# EAGLE schematic PS1 (EAGLE 9.6.2)
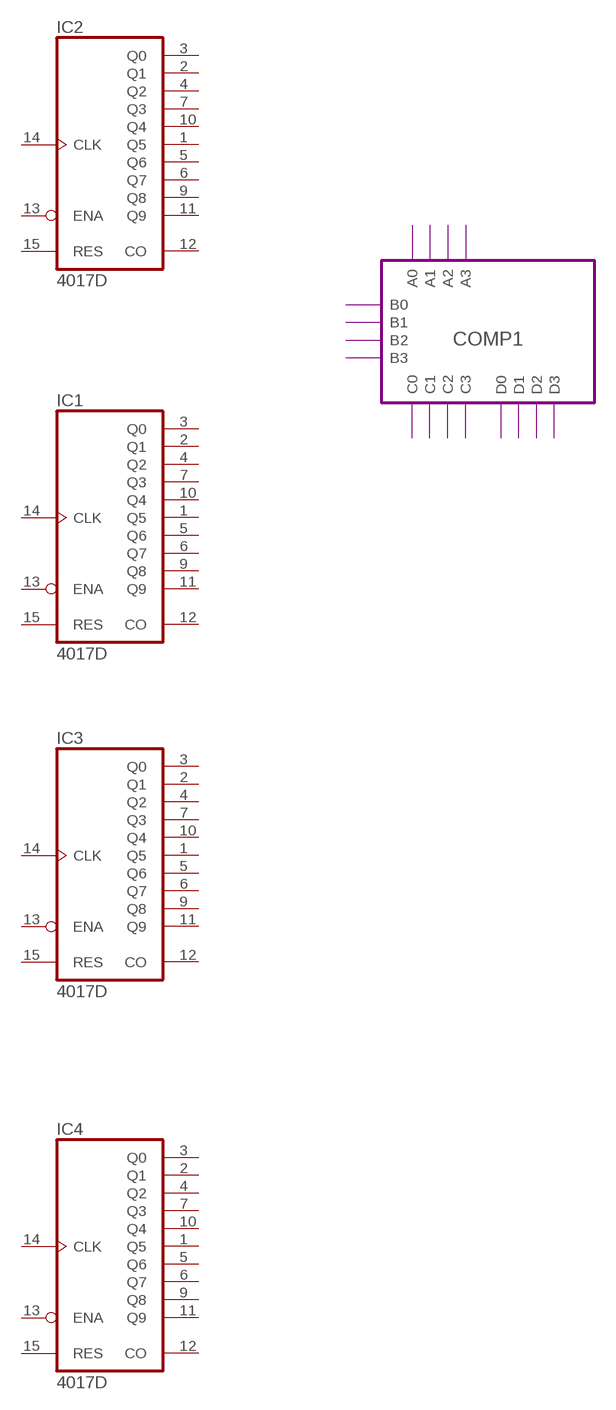
[diagram p0: schematic, sheet 1]

## Parts
IC1  4017D  [SO16]
IC2  4017D  [SO16]
IC3  4017D  [SO16]
IC4  4017D  [SO16]

## Module instances
COMP1 = COMP
Unconnected: IC1.1(Q5) IC1.2(Q1) IC1.3(Q0) IC1.4(Q2) IC1.5(Q6) IC1.6(Q7) IC1.7(Q3) IC1.9(Q8) IC1.10(Q4) IC1.11(Q9) IC1.12(CO) IC1.13(ENA) IC1.14(CLK) IC1.15(RES) IC2.1(Q5) IC2.2(Q1) IC2.3(Q0) IC2.4(Q2) IC2.5(Q6) IC2.6(Q7) IC2.7(Q3) IC2.9(Q8) IC2.10(Q4) IC2.11(Q9) IC2.12(CO) IC2.13(ENA) IC2.14(CLK) IC2.15(RES) IC3.1(Q5) IC3.2(Q1) IC3.3(Q0) IC3.4(Q2) IC3.5(Q6) IC3.6(Q7) IC3.7(Q3) IC3.9(Q8) IC3.10(Q4) IC3.11(Q9) IC3.12(CO) IC3.13(ENA) IC3.14(CLK) IC3.15(RES) IC4.1(Q5) IC4.2(Q1) IC4.3(Q0) IC4.4(Q2) IC4.5(Q6) IC4.6(Q7) IC4.7(Q3) IC4.9(Q8) IC4.10(Q4) IC4.11(Q9) IC4.12(CO) IC4.13(ENA) IC4.14(CLK) IC4.15(RES)

## Power pins joined to a net without a drawn wire
VDD: IC1.16(VDD) IC2.16(VDD) IC3.16(VDD) IC4.16(VDD)
VSS: IC1.8(VSS) IC2.8(VSS) IC3.8(VSS) IC4.8(VSS)

## Library data of the parts
IC1-IC4 = 40xx:4017: COUNTER/DIVIDER

## Module COMP
Ports: A0(io) A1(io) A2(io) A3(io) B0(io) B1(io) B2(io) B3(io) C0(io) C1(io) C2(io) C3(io) D0(io) D1(io) D2(io) D3(io)
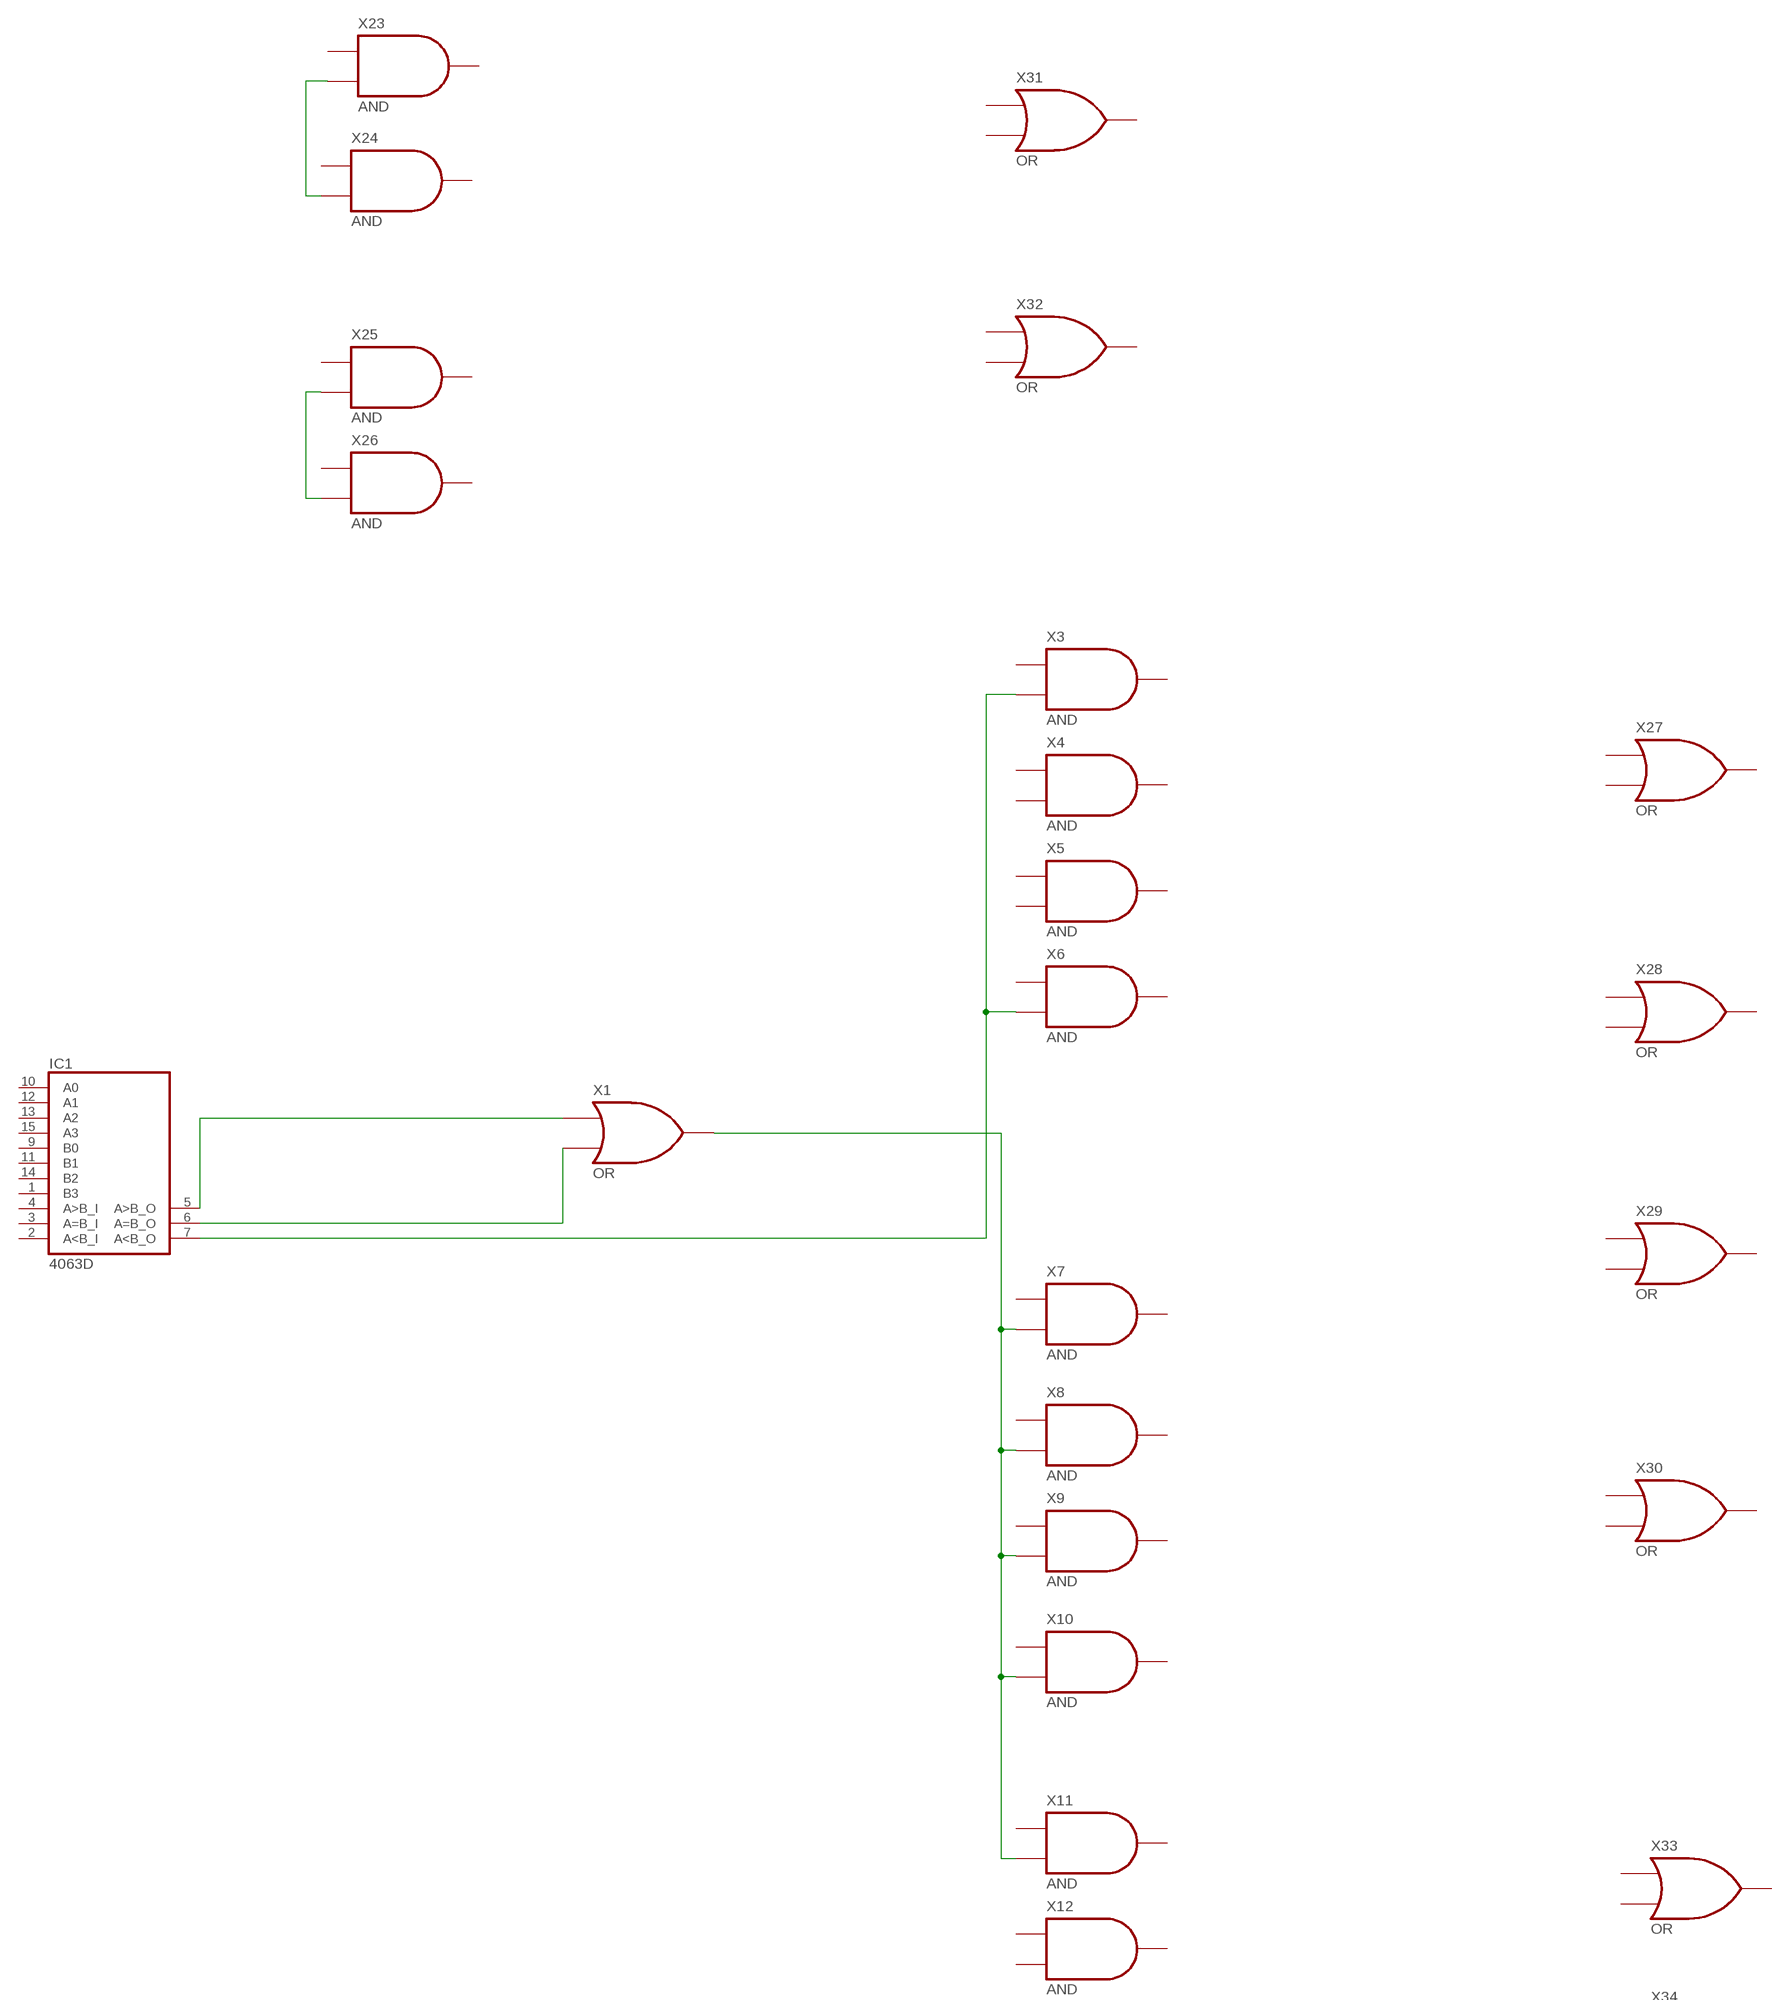
[diagram p1: schematic, module COMP, sheet 1, part 1 of 2]
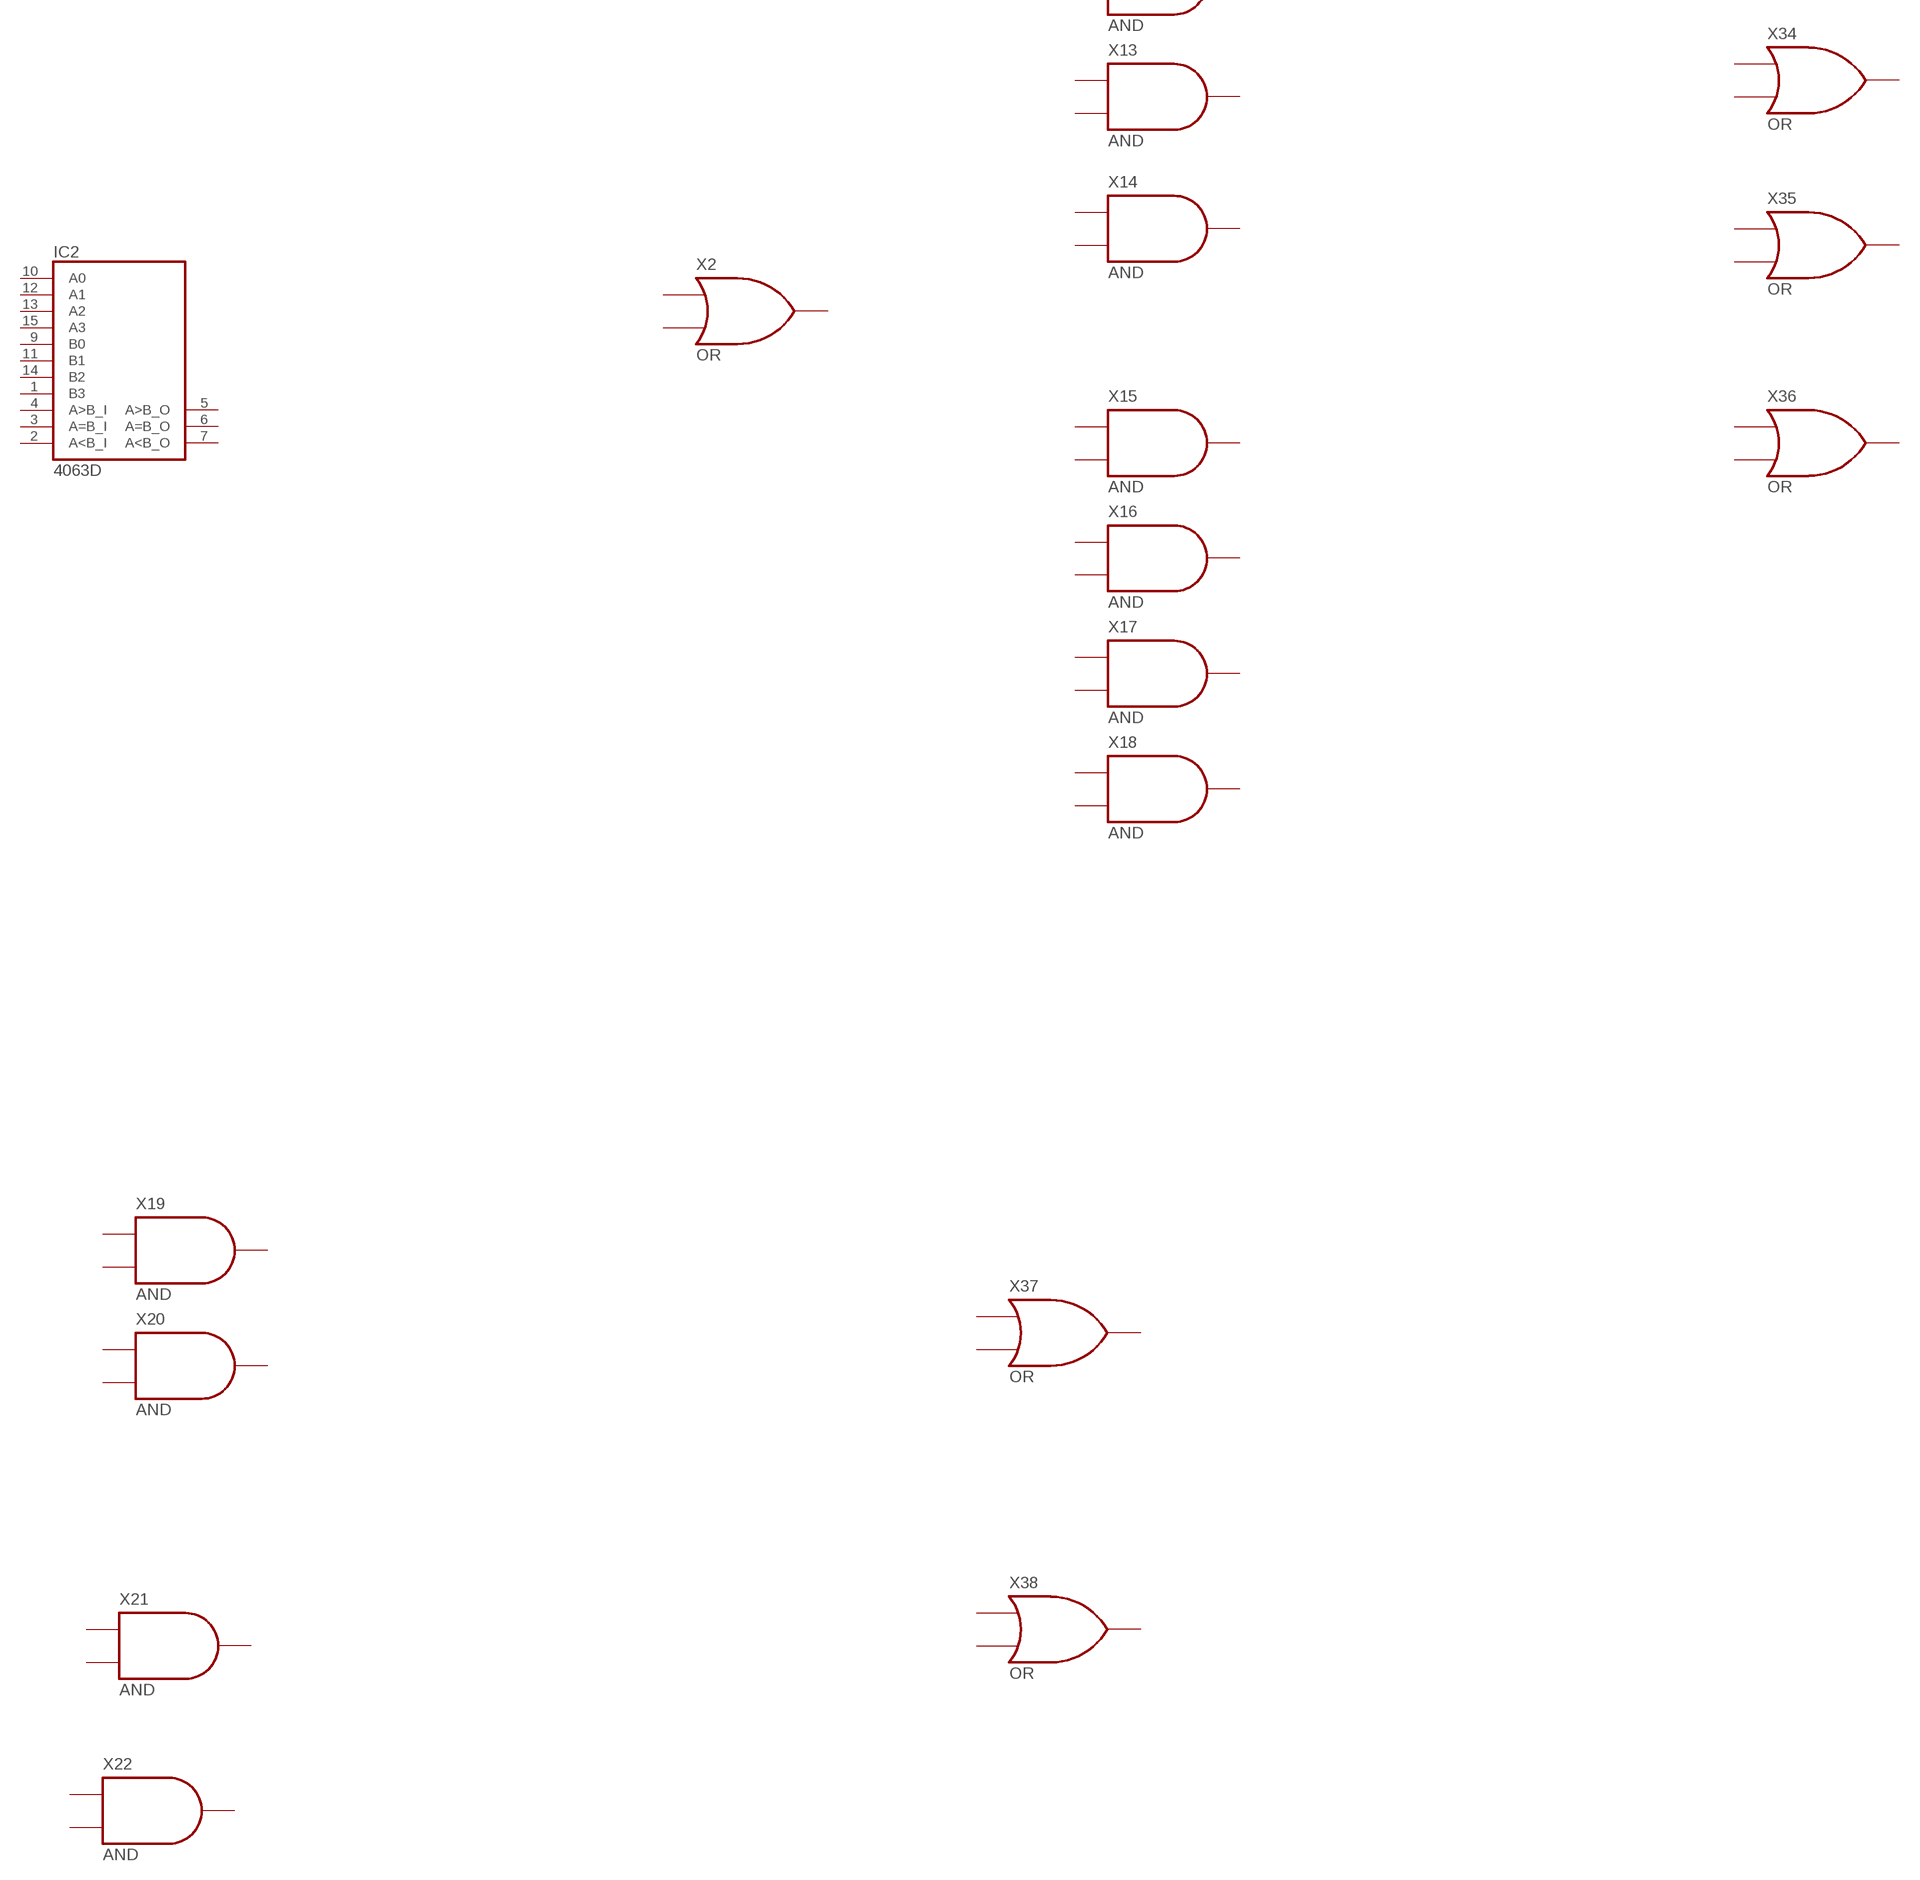
[diagram p2: schematic, module COMP, sheet 1, part 2 of 2]

### Parts
IC1  4063D  [SO16]
IC2  4063D  [SO16]
X1  OR  (no package)
X2  OR  (no package)
X3  AND  (no package)
X4  AND  (no package)
X5  AND  (no package)
X6  AND  (no package)
X7  AND  (no package)
X8  AND  (no package)
X9  AND  (no package)
X10  AND  (no package)
X11  AND  (no package)
X12  AND  (no package)
X13  AND  (no package)
X14  AND  (no package)
X15  AND  (no package)
X16  AND  (no package)
X17  AND  (no package)
X18  AND  (no package)
X19  AND  (no package)
X20  AND  (no package)
X21  AND  (no package)
X22  AND  (no package)
X23  AND  (no package)
X24  AND  (no package)
X25  AND  (no package)
X26  AND  (no package)
X27  OR  (no package)
X28  OR  (no package)
X29  OR  (no package)
X30  OR  (no package)
X31  OR  (no package)
X32  OR  (no package)
X33  OR  (no package)
X34  OR  (no package)
X35  OR  (no package)
X36  OR  (no package)
X37  OR  (no package)
X38  OR  (no package)

### Nets
N$1: IC1.5(A>B_O) X1.A
N$2: IC1.6(A=B_O) X1.B
N$3: IC1.7(A<B_O) X3.B X6.B
N$4: X1.Y X7.B X8.B X9.B X10.B X11.B
N$5: X23.B X24.B
N$6: X25.B X26.B
Unconnected: IC1.1(B3) IC1.2(A<B_I) IC1.3(A=B_I) IC1.4(A>B_I) IC1.9(B0) IC1.10(A0) IC1.11(B1) IC1.12(A1) IC1.13(A2) IC1.14(B2) IC1.15(A3) IC2.1(B3) IC2.2(A<B_I) IC2.3(A=B_I) IC2.4(A>B_I) IC2.5(A>B_O) IC2.6(A=B_O) IC2.7(A<B_O) IC2.9(B0) IC2.10(A0) IC2.11(B1) IC2.12(A1) IC2.13(A2) IC2.14(B2) IC2.15(A3) X2.A X2.B X2.Y X3.A X3.Y X4.A X4.B X4.Y X5.A X5.B X5.Y X6.A X6.Y X7.A X7.Y X8.A X8.Y X9.A X9.Y X10.A X10.Y X11.A X11.Y X12.A X12.B X12.Y X13.A X13.B X13.Y X14.A X14.B X14.Y X15.A X15.B X15.Y X16.A X16.B X16.Y X17.A X17.B X17.Y X18.A X18.B X18.Y X19.A X19.B X19.Y X20.A X20.B X20.Y X21.A X21.B X21.Y X22.A X22.B X22.Y X23.A X23.Y X24.A X24.Y X25.A X25.Y X26.A X26.Y X27.A X27.B X27.Y X28.A X28.B X28.Y X29.A X29.B X29.Y X30.A X30.B X30.Y X31.A X31.B X31.Y X32.A X32.B X32.Y X33.A X33.B X33.Y X34.A X34.B X34.Y X35.A X35.B X35.Y X36.A X36.B X36.Y X37.A X37.B X37.Y X38.A X38.B X38.Y

### Power pins joined to a net without a drawn wire
VDD: IC1.16(VDD) IC2.16(VDD)
VSS: IC1.8(VSS) IC2.8(VSS)

### Library data of the parts
IC1 IC2 = 40xx:4063: 4-bit magnitude COMPARATOR
X1 X2 X27-X38 = ngspice-digital:OR: 2 input logic OR gate
X3-X26 = ngspice-digital:AND: 2 input logic AND gate